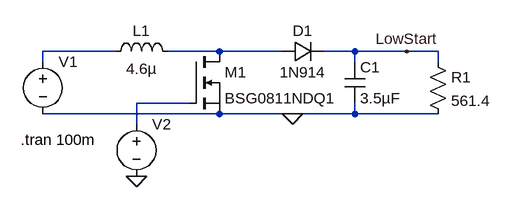
[diagram p0: schematic Single Stage Boost.asc]
Single Stage Boost.asc, the LTspice schematic file:
Version 4
SHEET 1 880 680
WIRE 144 128 32 128
WIRE 304 128 224 128
WIRE 400 128 304 128
WIRE 512 128 464 128
WIRE 592 128 512 128
WIRE 640 128 592 128
WIRE 32 144 32 128
WIRE 512 144 512 128
WIRE 640 144 640 128
WIRE 256 208 176 208
WIRE 304 224 32 224
WIRE 416 224 304 224
WIRE 512 224 512 208
WIRE 512 224 416 224
WIRE 640 224 512 224
WIRE 176 240 176 208
FLAG 416 224 0
FLAG 176 320 0
FLAG 592 128 LowStart
SYMBOL ind 128 144 R270
WINDOW 0 32 56 VTop 2
WINDOW 3 5 56 VBottom 2
SYMATTR InstName L1
SYMATTR Value 4.6µ
SYMATTR SpiceLine Rser=.1
SYMBOL cap 496 144 R0
SYMATTR InstName C1
SYMATTR Value 3.5µF
SYMATTR SpiceLine Rser=.1
SYMBOL res 624 128 R0
SYMATTR InstName R1
SYMATTR Value 561.4
SYMBOL voltage 32 128 R0
WINDOW 3 24 96 Invisible 2
WINDOW 123 0 0 Left 2
WINDOW 39 0 0 Left 2
SYMATTR InstName V1
SYMATTR Value 9
SYMBOL nmos 256 128 R0
SYMATTR InstName M1
SYMATTR Value BSG0811NDQ1
SYMBOL diode 400 144 R270
WINDOW 0 32 32 VTop 2
WINDOW 3 0 32 VBottom 2
SYMATTR InstName D1
SYMATTR Value 1N914
SYMBOL voltage 176 224 R0
WINDOW 3 24 96 Invisible 2
WINDOW 123 0 0 Left 2
WINDOW 39 0 0 Left 2
SYMATTR InstName V2
SYMATTR Value PULSE(0 15 0 0 0 9.775u 10u)
TEXT -2 264 Left 2 !.tran 100m

The netlist it stands for:
* Single Stage Boost.asc
L1 N001 N002 4.6µ Rser=.1
C1 LowStart 0 3.5µF Rser=.1
R1 LowStart 0 561.4
V1 N001 0 9
M1 N002 N003 0 0 BSG0811NDQ1
D1 N002 LowStart 1N914
V2 N003 0 PULSE(0 15 0 0 0 9.775u 10u)
.model D D
.lib standard.dio
.model NMOS NMOS
.model PMOS PMOS
.lib standard.mos
.tran 100m
.backanno
.end